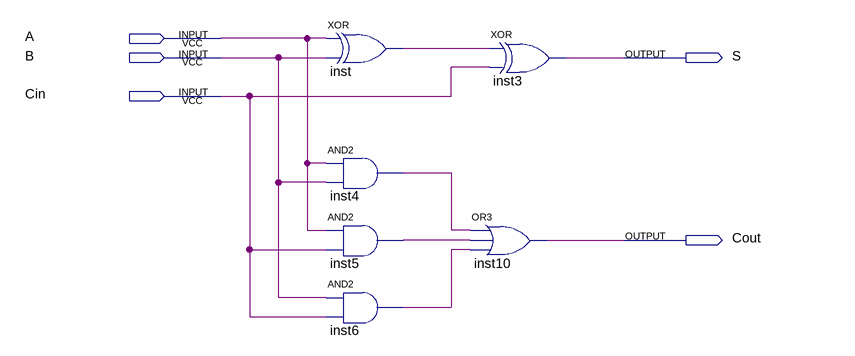
[diagram p0: schematic sheet]
// Quartus schematic FA.bdf as structural Verilog: 6 symbols, 5 pins
module FA (
  input  A,
  input  B,
  input  Cin,
  output S,
  output Cout
);

  wire inst4_out, inst5_out, inst6_out, inst_out;

  xor inst (inst_out, A, B);
  and inst4 (inst4_out, A, B);
  and inst5 (inst5_out, A, Cin);
  and inst6 (inst6_out, B, Cin);
  or inst10 (Cout, inst4_out, inst5_out, inst6_out);
  xor inst3 (S, inst_out, Cin);
endmodule
